# Altium project Any_Thing.PrjPCB
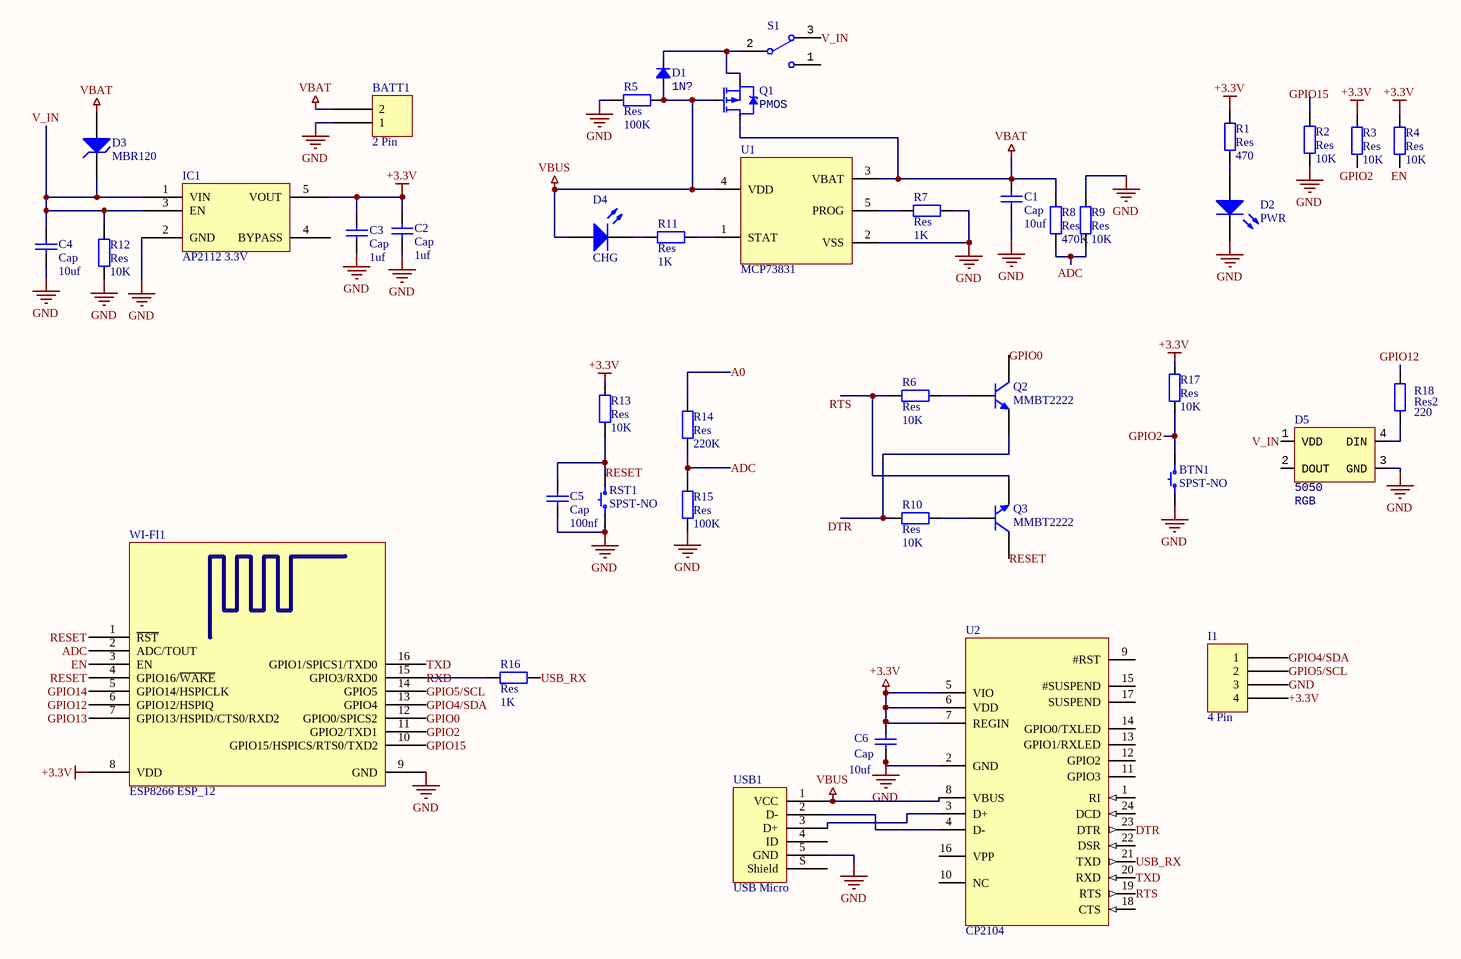
[diagram p0: Any_Thing_Schematic.SchDoc]
1 sheet, 42 parts. Net scope: global (net labels, ports and power ports of the same name join across sheets).
Board file: Any_Thing_PCB.PcbDoc

## Sheet Any_Thing_Schematic.SchDoc
size A3

### Parts
BATT1  2 Pin  [JST B2B-PH-K]
BTN1  SPST-NO  [BUT: 12x12]
C1  Cap  value 10uf  [CAP 0805/2012]
C2  Cap  value 1uf  [CAP 0805/2012]
C3  Cap  value 1uf  [CAP 0805/2012]
C4  Cap  value 10uf  [CAP 0805/2012]
C5  Cap  value 100nf  [CAP 0805/2012]
C6  Cap  value 10uf  [CAP 0805/2012]
D1  1N?  [SOD-123]
D2  PWR  [SMD: LED 0805/2012 RED]
D3  MBR120  [SOD-123]
D4  CHG  [SMD: LED 0805/2012 GREEN]
D5  Type: 5050  [SMD_LED_5050_WS2812B]  (hidden comment: RGB)
I1  4 Pin
IC1  AP2112 3.3V  [TI SOT-23-5 DBV]
Q1  PMOS  [INFINEON SOT-23-3]
Q2  MMBT2222  [DIODES SOT-23-3]
Q3  MMBT2222  [DIODES SOT-23-3]
R1  Res  value 470  [RES 0805/2012]
R2  Res  value 10K  [RES 0805/2012]
R3  Res  value 10K  [RES 0805/2012]
R4  Res  value 10K  [RES 0805/2012]
R5  Res  value 100K  [RES 0805/2012]
R6  Res  value 10K  [RES 0805/2012]
R7  Res  value 1K  [RES 0805/2012]
R8  Res  value 470K  [RES 0805/2012]
R9  Res  value 10K  [RES 0805/2012]
R10  Res  value 10K  [RES 0805/2012]
R11  Res  value 1K  [RES 0805/2012]
R12  Res  value 10K  [RES 0805/2012]
R13  Res  value 10K  [RES 0805/2012]
R14  Res  value 220K  [RES 0805/2012]
R15  Res  value 100K  [RES 0805/2012]
R16  Res  value 1K  [RES 0805/2012]
R17  Res  value 10K  [RES 0805/2012]
R18  Res2  value 220  [RES 0805/2012]
RST1  SPST-NO  [ButtonTACT_4P_3x4x2_180]
S1  SPDT 3P  [Switch: SPDT_4.3X8.6_D90]  (value not drawn)
U1  MCP73831  [TI SOT-23-5 DBV]
U2  CP2104  [24-QFN]
USB1  USB Micro  [FCI USB 10118193-0001LF]
WI-FI1  ESP8266 ESP_12  [ESP8266 ESP_12]

### Nets
+3.3V: C2.2 C3.2 C6.2 I1.4 IC1.5(VOUT) R1.1 R3.1 R4.1 R13.2 R17.2 U2.5(VIO) U2.6(VDD) U2.7(REGIN) WI-FI1.8(VDD)
GND: BATT1.1 BTN1.1 C1.1 C2.1 C3.1 C4.1 C5.1 C6.1 D2.2(K) D5.3(GND) I1.3 IC1.2(GND) R2.2 R5.2 R7.1 R9.1 R12.1 R15.2 RST1.1 U1.2(VSS) U2.2(GND) USB1.5(GND) WI-FI1.9(GND)
VBAT: BATT1.2 C1.2 D3.1(A) Q1.4(D) R8.1 U1.3(VBAT)
VBUS: D1.1(A) D4.1(A) Q1.1(G) R5.1 U1.4(VDD) U2.8(VBUS) USB1.1(VCC)
A0: R14.1
ADC: R8.2 R9.2 R14.2 R15.1 WI-FI1.2(ADC/TOUT)
DTR: Q2.3(E) R10.2 U2.23(DTR)
EN: R4.2 WI-FI1.3(EN)
GPIO0: Q2.1(C) WI-FI1.12(GPIO0/SPICS2)
GPIO2: BTN1.3 R3.2 R17.1 WI-FI1.11(GPIO2/TXD1)
GPIO4/SDA: I1.1 WI-FI1.13(GPIO4)
GPIO5/SCL: I1.2 WI-FI1.14(GPIO5)
GPIO12: R18.2 WI-FI1.6(GPIO12/HSPIQ)
GPIO13: WI-FI1.7(GPIO13/HSPID/CTS0/RXD2)
GPIO14: WI-FI1.5(GPIO14/HSPICLK)
GPIO15: R2.1 WI-FI1.10(GPIO15/HSPICS/RTS0/TXD2)
RESET: C5.2 Q3.1(C) R13.1 RST1.3 WI-FI1.1(~{RST}) WI-FI1.4(GPIO16/~{WAKE})
RTS: Q3.3(E) R6.2 U2.19(RTS)
RXD: R16.2 WI-FI1.15(GPIO3/RXD0)
TXD: U2.20(RXD) WI-FI1.16(GPIO1/SPICS1/TXD0)
USB_RX: R16.1 U2.21(TXD)
V_IN: C4.2 D3.2(K) D5.1(VDD) IC1.1(VIN) IC1.3(EN) R12.2 S1.3
NetD1_2: D1.2(K) Q1.3(S) S1.2
NetD2_1: D2.1(A) R1.2
NetD4_2: D4.2(K) R11.2
NetD5_4: D5.4(DIN) R18.1
NetQ2_2: Q2.2(B) R6.1
NetQ3_2: Q3.2(B) R10.1
NetR7_2: R7.2 U1.5(PROG)
NetR11_1: R11.1 U1.1(STAT)
NetU2_3: U2.3(D+) USB1.3(D+)
NetU2_4: U2.4(D-) USB1.2(D-)

Not connected (* = marked no-connect by the designer): D5 2(DOUT); IC1 4(BYPASS); S1 1; U2 1(RI) 9(#RST) 10(NC) 11(GPIO3) 12(GPIO2) 13(GPIO1/RXLED) 14(GPIO0/TXLED) 15(#SUSPEND) 16(VPP) 17(SUSPEND) 18(CTS) 22(DSR) 24(DCD); USB1 4(ID) S(Shield)

### Library data of the parts
BTN1 RST1 = NKK AB11AH-HA: pin to pad: 3>2
C1-C6 = Cap: Capacitor; Published: 8-Jun-2000; LatestRevisionDate: 17-Jul-2002; LatestRevisionNote: Re-released for DXP Platform.; PackageReference: RAD-0.3; Publisher: Altium Limited; PackageDescription: Radial Cap, Thru-Hole; 2 Leads; 0.3 in Pin Spacing
D1 = Diode_SOD123: Diode; Type: SOD123; Value: 1N?
D2 D4 = LED0: Typical INFRARED GaAs LED; Published: 8-Jun-2000; LatestRevisionDate: 08-Jul-2005; LatestRevisionNote: Mech Layer 1 removed.; PackageReference: LED-0; Publisher: Altium Limited; PackageDescription: LED; 2 Leads
D3 = D Zener: Zener Diode; Published: 8-Jun-2000; LatestRevisionDate: 17-Jul-2002; LatestRevisionNote: Re-released for DXP Platform.; PackageReference: DIODE-0.7; Publisher: Altium Limited; PackageDescription: Diode, Thru-Hole; 2 Leads; 0.7 in Pin Spacing
D5 = LED_5050_WS2812B: LED; Value: RGB
IC1 = TI LP3985: Micropower 150mA Low-Noise Ultra Low-Dropout CMOS Voltage Regulator
Q1 = MOSFET_P_TO252: MOSFET; pin to pad: 4>2; Value: PMOS
Q2 Q3 = NPN: NPN Bipolar Transistor; Published: 8-Jun-2000; LatestRevisionDate: 17-Jul-2002; LatestRevisionNote: Re-released for DXP Platform.; PackageReference: TO-226-AA; Publisher: Altium Limited; PackageDescription: TO, Flat Index; 3 In-Line, Axial Leads; Body Dia. 4.8mm; Leads 0.55 x 0.51 mm (max); Code_JEDEC: TO-226-AA
R1-R18 = Res2: Resistor; Published: 8-Jun-2000; LatestRevisionDate: 17-Jul-2002; LatestRevisionNote: Re-released for DXP Platform.; PackageReference: AXIAL-0.4; Publisher: Altium Limited; PackageDescription: Axial Device, Thru-Hole; 2 Leads; 0.4 in Pin Spacing
S1 = SwitchSPDT_2.8x6.6_90: Switch; Value: SPDT 3P; Type: SPDT
USB1 = USB 2.0 Type B Micro
WI-FI1 = ESP8266 ESP_12: ESP8266 ESP-12; IC: ESP8266-EX; Vendor: Ai-thinker; LatestReviewer: Zion Blue; Published: 14-Apr-2015; Publisher: Cynetik Group; LatestRevisionData: 14-Apr-2015; LatestRevisionNote: Include 3D body and Footprint